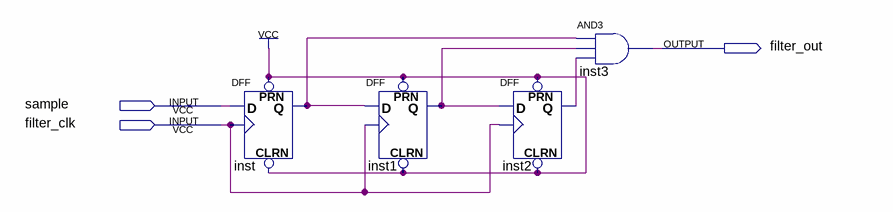
[diagram p0: schematic sheet]
// Quartus schematic filter.bdf as structural Verilog: 4 symbols, 3 pins
module filter (
  input  sample,
  input  filter_clk,
  output filter_out
);

  wire inst1_q, inst2_q, inst_q;

  DFF inst (.CLRN(1'b1), .CLK(filter_clk), .D(sample), .PRN(1'b1), .Q(inst_q));
  DFF inst1 (.CLRN(1'b1), .CLK(filter_clk), .D(inst_q), .PRN(1'b1), .Q(inst1_q));
  DFF inst2 (.CLRN(1'b1), .CLK(filter_clk), .D(inst1_q), .PRN(1'b1), .Q(inst2_q));
  and inst3 (filter_out, inst_q, inst1_q, inst2_q);
endmodule
